# EAGLE design BMS12v3 (EAGLE 9.5.1)
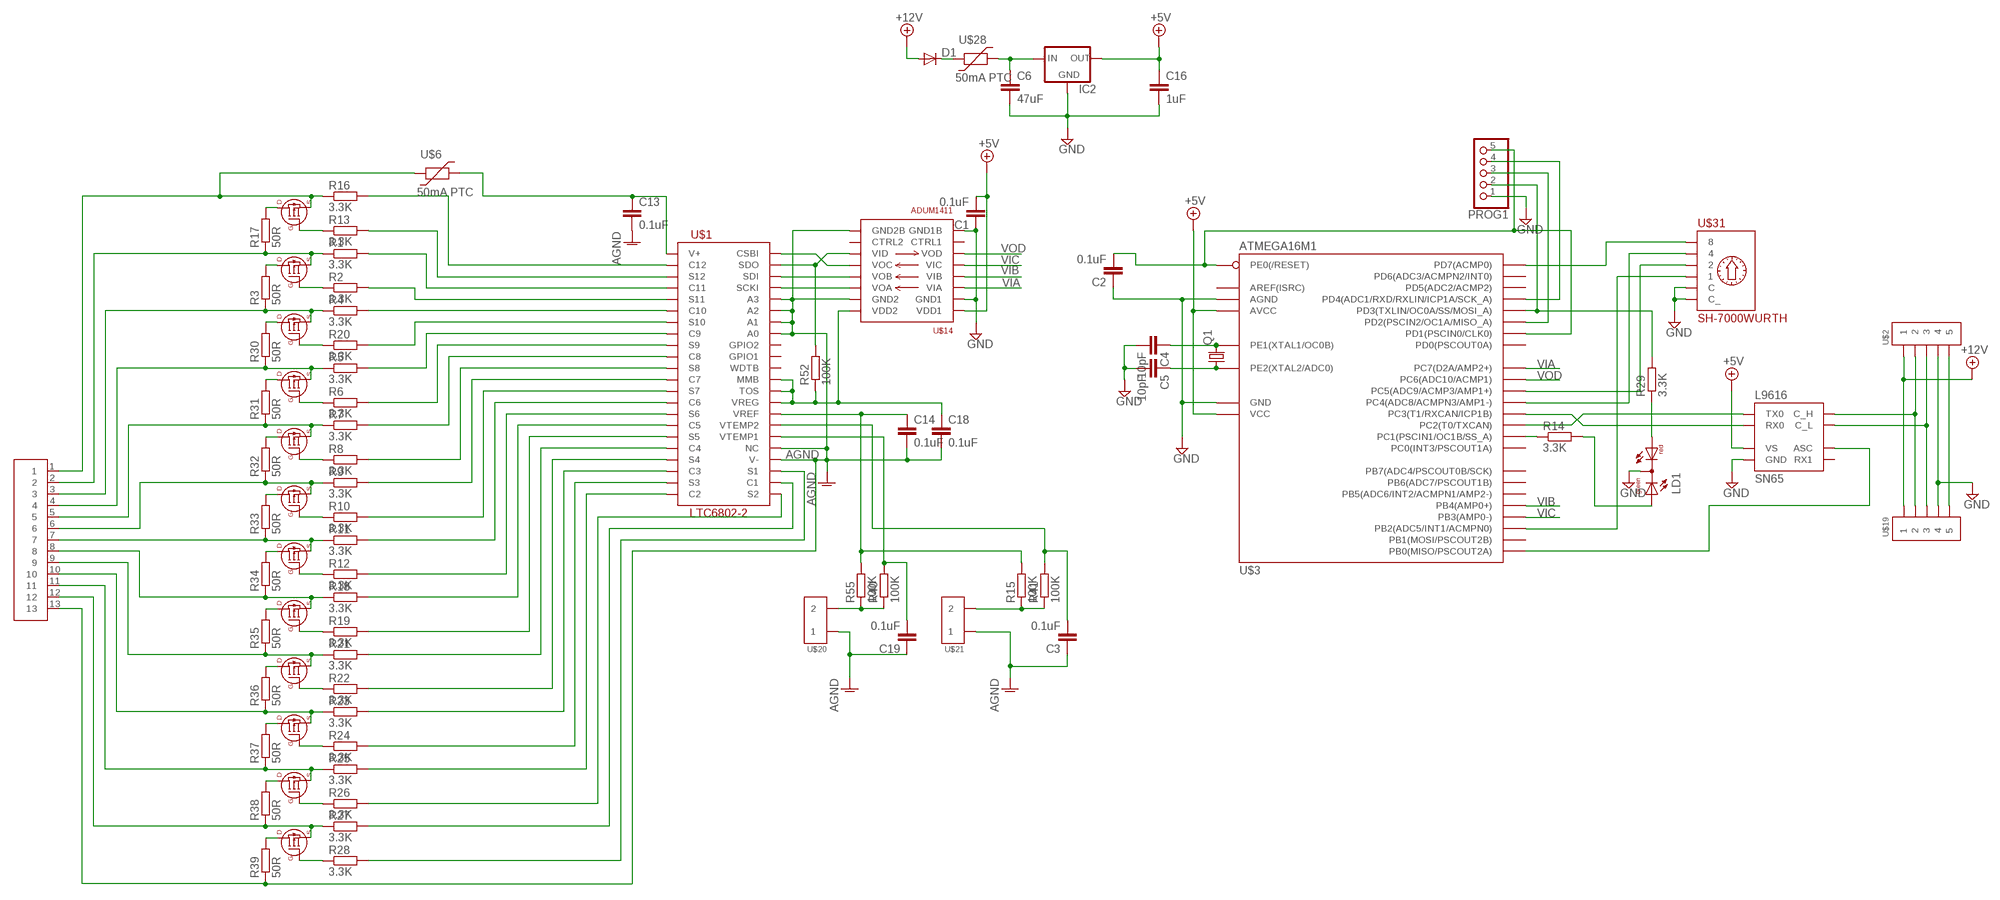
[diagram p0: schematic, sheet 1]

## Parts
C1  0.1uF  C-EUC0805  [C0805]
C2  0.1uF  C-EUC0805  [C0805]
C3  0.1uF  C-EUC0805  [C0805]
C4  10pF  C-EUC0805  [C0805]
C5  10pF  C-EUC0805  [C0805]
C6  47uF  C-EUC1206  [C1206]
C13  0.1uF  C-EUC0805  [C0805]
C14  0.1uF  C-EUC0805  [C0805]
C16  1uF  C-EUC0805  [C0805]
C18  0.1uF  C-EUC0805  [C0805]
C19  0.1uF  C-EUC0805  [C0805]
D1  DIODE-SOD123  [SOD123]
IC2  78LXXSOT89  [SOT89R]
LD1  DUOLED-RG-C  [DUOLED-C-5MM]
PROG1  PINHD-1X5  [1X05]
Q1  CRYSTALCTS406  [CTS406]
R1  3.3K  R-EU_R0805  [R0805]
R2  3.3K  R-EU_R0805  [R0805]
R3  50R  R-EU_R2512  [R2512]
R4  3.3K  R-EU_R0805  [R0805]
R5  3.3K  R-EU_R0805  [R0805]
R6  3.3K  R-EU_R0805  [R0805]
R7  3.3K  R-EU_R0805  [R0805]
R8  3.3K  R-EU_R0805  [R0805]
R9  3.3K  R-EU_R0805  [R0805]
R10  3.3K  R-EU_R0805  [R0805]
R11  3.3K  R-EU_R0805  [R0805]
R12  3.3K  R-EU_R0805  [R0805]
R13  3.3K  R-EU_R0805  [R0805]
R14  3.3K  R-EU_R0805  [R0805]
R15  100K  R-EU_R0805  [R0805]
R16  3.3K  R-EU_R0805  [R0805]
R17  50R  R-EU_R2512  [R2512]
R18  3.3K  R-EU_R0805  [R0805]
R19  3.3K  R-EU_R0805  [R0805]
R20  3.3K  R-EU_R0805  [R0805]
R21  3.3K  R-EU_R0805  [R0805]
R22  3.3K  R-EU_R0805  [R0805]
R23  3.3K  R-EU_R0805  [R0805]
R24  3.3K  R-EU_R0805  [R0805]
R25  3.3K  R-EU_R0805  [R0805]
R26  3.3K  R-EU_R0805  [R0805]
R27  3.3K  R-EU_R0805  [R0805]
R28  3.3K  R-EU_R0805  [R0805]
R29  3.3K  R-EU_R0805  [R0805]
R30  50R  R-EU_R2512  [R2512]
R31  50R  R-EU_R2512  [R2512]
R32  50R  R-EU_R2512  [R2512]
R33  50R  R-EU_R2512  [R2512]
R34  50R  R-EU_R2512  [R2512]
R35  50R  R-EU_R2512  [R2512]
R36  50R  R-EU_R2512  [R2512]
R37  50R  R-EU_R2512  [R2512]
R38  50R  R-EU_R2512  [R2512]
R39  50R  R-EU_R2512  [R2512]
R40  100K  R-EU_R0805  [R0805]
R41  100K  R-EU_R0805  [R0805]
R52  100K  R-EU_R0805  [R0805]
R55  100K  R-EU_R0805  [R0805]
SN65  L9616  [SOIC8]
U$1  LTC6802-2  [SSOP-44]
U$2  MOLEX-39502-1005  [MOLEX-39502-1005]
U$3  ATMEGA16M1  [TQFP32]
U$4  SI2351DS  [SOT23]
U$5  SI2351DS  [SOT23]
U$6  50mA PTC  1206_POLYSWITCH  [1206]
U$7  SI2351DS  [SOT23]
U$8  SI2351DS  [SOT23]
U$9  SI2351DS  [SOT23]
U$10  SI2351DS  [SOT23]
U$11  SI2351DS  [SOT23]
U$12  SI2351DS  [SOT23]
U$13  SI2351DS  [SOT23]
U$14  ADUM1411  [SOIC16W]
U$15  SI2351DS  [SOT23]
U$16  SI2351DS  [SOT23]
U$17  SI2351DS  [SOT23]
U$18  MOLEX_TERM_BLOCK_13  [MOLEX_TERM_BLOCK_13]
U$19  MOLEX-39502-1005  [MOLEX-39502-1005]
U$20  MOLEX-39502-1002  [MOLEX-39502-1002]
U$21  MOLEX-39502-1002  [MOLEX-39502-1002]
U$28  50mA PTC  1206_POLYSWITCH  [1206]
U$31  SH-7000WURTH  [WS-ROTV]

## Nets
+5V: C1.2 C16.1 IC2.2(OUT) SN65.P$3(VS) U$3.4(VCC) U$3.19(AVCC) U$14.1(VDD1)
+12V: D1.A U$2.1 U$19.1
AGND: C3.1 C13.2 C14.2 C18.2 C19.1 R39.1 U$1.26(V-) U$1.27(NC) U$1.37(A0) U$1.38(A1) U$1.39(A2) U$1.40(A3) U$14.9(GND2B) U$14.15(GND2) U$18.13 U$20.1 U$21.1
GND: C1.1 C2.1 C4.2 C5.2 C6.2 C16.2 IC2.4(GND) LD1.C PROG1.1 SN65.P$2(GND) U$2.4 U$3.5(GND) U$3.20(AGND) U$14.2(GND1) U$14.8(GND1B) U$19.4 U$31.C U$31.C2(C_)
N$1: D1.C U$28.P$1
N$2: R16.2 U$1.2(C12)
N$3: R13.2 U$1.3(S12)
N$4: R3.2 U$5.P$3(D)
N$5: R1.2 U$1.4(C11)
N$6: R1.1 R17.1 U$5.P$2(S) U$18.2
N$7: U$1.42(SDI) U$14.13(VOB)
N$8: R3.1 R4.1 U$7.P$2(S) U$18.3
N$9: R4.2 U$1.6(C10)
N$10: R26.2 U$1.23(S2)
N$11: U$1.41(SCKI) U$14.14(VOA)
N$12: R27.2 U$1.24(C1)
N$13: R28.2 U$1.25(S1)
N$14: R2.2 U$1.5(S11)
N$15: R52.2 U$1.43(SDO) U$14.11(VID)
N$16: U$1.44(CSBI) U$14.12(VOC)
N$17: R2.1 U$5.P$1(G)
N$18: R30.2 U$7.P$3(D)
N$19: C2.2 PROG1.5 U$3.31(PE0(/RESET)) U$3.32(PD1(PSCIN0/CLK0))
N$20: C6.1 IC2.1(IN) U$28.P$2
N$21: R5.2 U$1.8(C9)
N$22: R7.2 U$1.10(C8)
N$23: R9.2 U$1.12(C7)
N$24: R11.2 U$1.14(C6)
N$25: C18.1 R52.1 U$1.31(VREG) U$1.32(TOS) U$1.33(MMB) U$14.16(VDD2)
N$26: R18.2 U$1.16(C5)
N$27: R21.2 U$1.18(C4)
N$28: R23.2 U$1.20(C3)
N$29: R25.2 U$1.22(C2)
N$30: SN65.P$8(ASC) U$3.8(PB0(MISO/PSCOUT2A))
N$31: R5.1 R30.1 U$8.P$2(S) U$18.4
N$32: PROG1.2 R29.2 U$3.2(PD3(TXLIN/OC0A/SS/MOSI_A))
N$33: PROG1.3 U$3.1(PD2(PSCIN2/OC1A/MISO_A))
N$34: PROG1.4 U$3.12(PD4(ADC1/RXD/RXLIN/ICP1A/SCK_A))
N$36: SN65.P$4(RX0) U$3.7(PC3(T1/RXCAN/ICP1B))
N$37: SN65.P$1(TX0) U$3.6(PC2(T0/TXCAN))
N$38: SN65.P$7(C_H) U$2.2 U$19.2
N$39: SN65.P$6(C_L) U$2.3 U$19.3
N$40: LD1.AX(AG) R14.2
N$41: R14.1 U$3.3(PC1(PSCIN1/OC1B/SS_A))
N$42: U$3.15(PD7(ACMP0)) U$31.8
N$43: U$3.16(PB2(ADC5/INT1/ACMPN0)) U$31.1
N$44: U$3.17(PC4(ADC8/ACMPN3/AMP1-)) U$31.4
N$45: U$3.18(PC5(ADC9/ACMP3/AMP1+)) U$31.2
N$46: C3.2 R41.2 U$1.29(VTEMP2)
N$47: U$2.5 U$19.5
N$48: C4.1 Q1.3 U$3.10(PE1(XTAL1/OC0B))
N$49: C5.1 Q1.1 U$3.11(PE2(XTAL2/ADC0))
N$50: R17.2 U$4.P$3(D)
N$51: R16.1 U$4.P$2(S) U$6.P$1 U$18.1
N$52: R13.1 U$4.P$1(G)
N$53: R7.1 R31.1 U$9.P$2(S) U$18.5
N$54: R31.2 U$8.P$3(D)
N$55: R6.1 U$8.P$1(G)
N$56: R20.1 U$7.P$1(G)
N$57: R8.1 U$9.P$1(G)
N$58: R10.1 U$10.P$1(G)
N$59: R12.1 U$11.P$1(G)
N$60: R28.1 U$17.P$1(G)
N$61: R19.1 U$12.P$1(G)
N$62: R22.1 U$13.P$1(G)
N$63: R24.1 U$15.P$1(G)
N$64: R26.1 U$16.P$1(G)
N$65: R27.1 R38.1 U$17.P$2(S) U$18.12
N$66: C14.1 R15.2 R55.2 U$1.30(VREF)
N$67: C19.2 R40.2 U$1.28(VTEMP1)
N$68: LD1.AR R29.1
N$69: R25.1 R37.1 U$16.P$2(S) U$18.11
N$70: R23.1 R36.1 U$15.P$2(S) U$18.10
N$71: R38.2 U$16.P$3(D)
N$72: R39.2 U$17.P$3(D)
N$73: R37.2 U$15.P$3(D)
N$74: R21.1 R35.1 U$13.P$2(S) U$18.9
N$75: R36.2 U$13.P$3(D)
N$76: R18.1 R34.1 U$12.P$2(S) U$18.8
N$77: R35.2 U$12.P$3(D)
N$78: R11.1 R33.1 U$11.P$2(S) U$18.7
N$79: R9.1 R32.1 U$10.P$2(S) U$18.6
N$80: R33.2 U$10.P$3(D)
N$81: R34.2 U$11.P$3(D)
N$82: R32.2 U$9.P$3(D)
N$83: R24.2 U$1.21(S3)
N$84: R22.2 U$1.19(S4)
N$85: R40.1 R55.1 U$20.2
N$86: R15.1 R41.1 U$21.2
N$87: R20.2 U$1.7(S10)
N$88: R6.2 U$1.9(S9)
N$89: R8.2 U$1.11(S8)
N$90: R10.2 U$1.13(S7)
N$91: R12.2 U$1.15(S6)
N$93: R19.2 U$1.17(S5)
V+: C13.1 U$1.1(V+) U$6.P$2
VIA: U$3.25(PC7(D2A/AMP2+)) U$14.3(VIA)
VIB: U$3.24(PB4(AMP0+)) U$14.4(VIB)
VIC: U$3.23(PB3(AMP0-)) U$14.5(VIC)
VOD: U$3.22(PC6(ADC10/ACMP1)) U$14.6(VOD)
Unconnected: SN65.P$5(RX1) U$1.34(WDTB) U$1.35(GPIO1) U$1.36(GPIO2) U$3.9(PB1(MOSI/PSCOUT2B)) U$3.13(PD5(ADC2/ACMP2)) U$3.14(PD6(ADC3/ACMPN2/INT0)) U$3.21(AREF(ISRC)) U$3.26(PB5(ADC6/INT2/ACMPN1/AMP2-)) U$3.27(PB6(ADC7/PSCOUT1B)) U$3.28(PB7(ADC4/PSCOUT0B/SCK)) U$3.29(PD0(PSCOUT0A)) U$3.30(PC0(INT3/PSCOUT1A)) U$14.7(CTRL1) U$14.10(CTRL2)

## Library data of the parts
C1-C6 C13 C14 C16 C18 C19 = resistor:C-EU: CAPACITOR, European symbol
D1 = diode:DIODE-: DIODE
IC2 = v-reg:78LXX: VOLTAGE REGULATOR
LD1 = led:DUOLED-RG-C: DUO LED 2 colors (red/green), 5 mm, round, common Cathode www.ligitek.com or other producers.
PROG1 = pinhead:PINHD-1X5: PIN HEADER
Q1 = crystal:CRYSTAL: CRYSTAL
R1-R41 R52 R55 = resistor:R-EU_: RESISTOR, European symbol
SN65 = Ians parts:L9616
U$1 = Ians parts:LTC6802-2
U$2 U$19 = Ians parts:MOLEX-39502-1005
U$3 = Ians parts:ATMEGA16M1
U$4 U$5 U$7-U$13 U$15-U$17 = Ians parts:SI2351DS
U$6 U$28 = Ians parts:1206_POLYSWITCH
U$14 = Ians parts:ADUM1411
U$18 = Ians parts:MOLEX_TERM_BLOCK_13
U$20 U$21 = Ians parts:MOLEX-39502-1002
U$31 = Ians parts:SH-7000

## Board
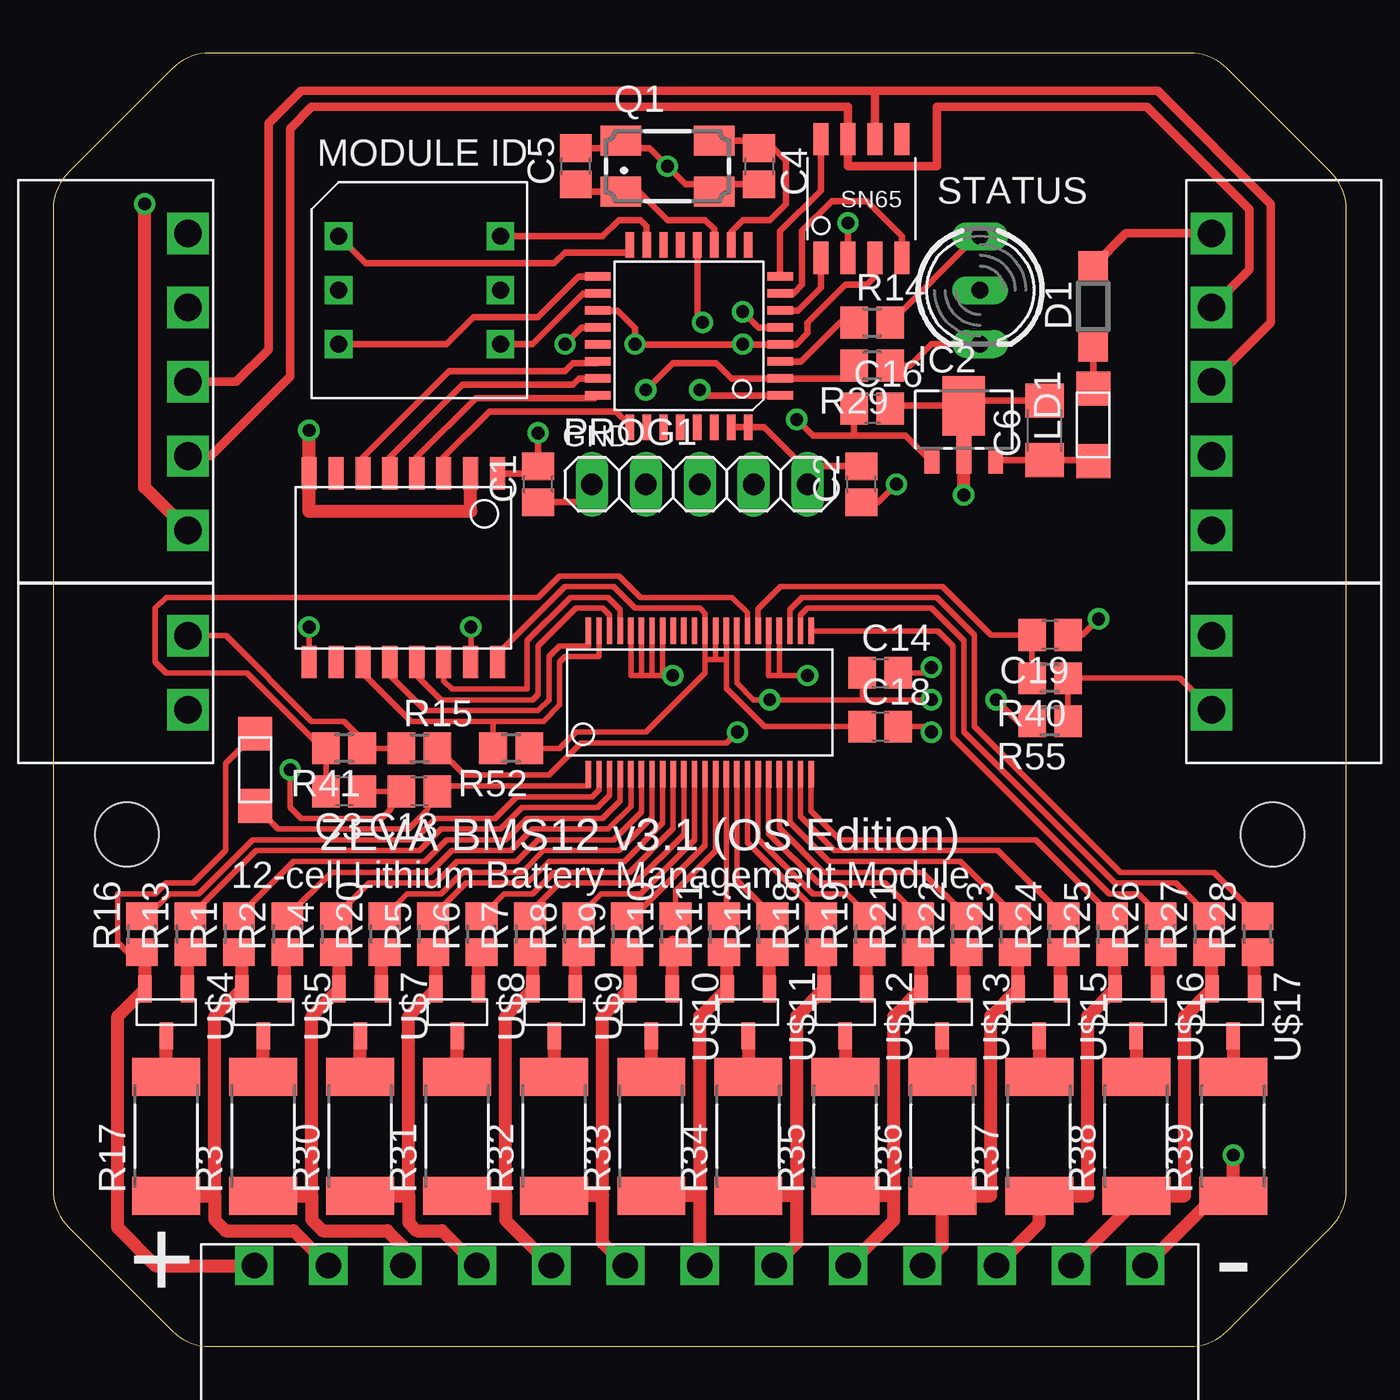
[diagram p1: board, top side]
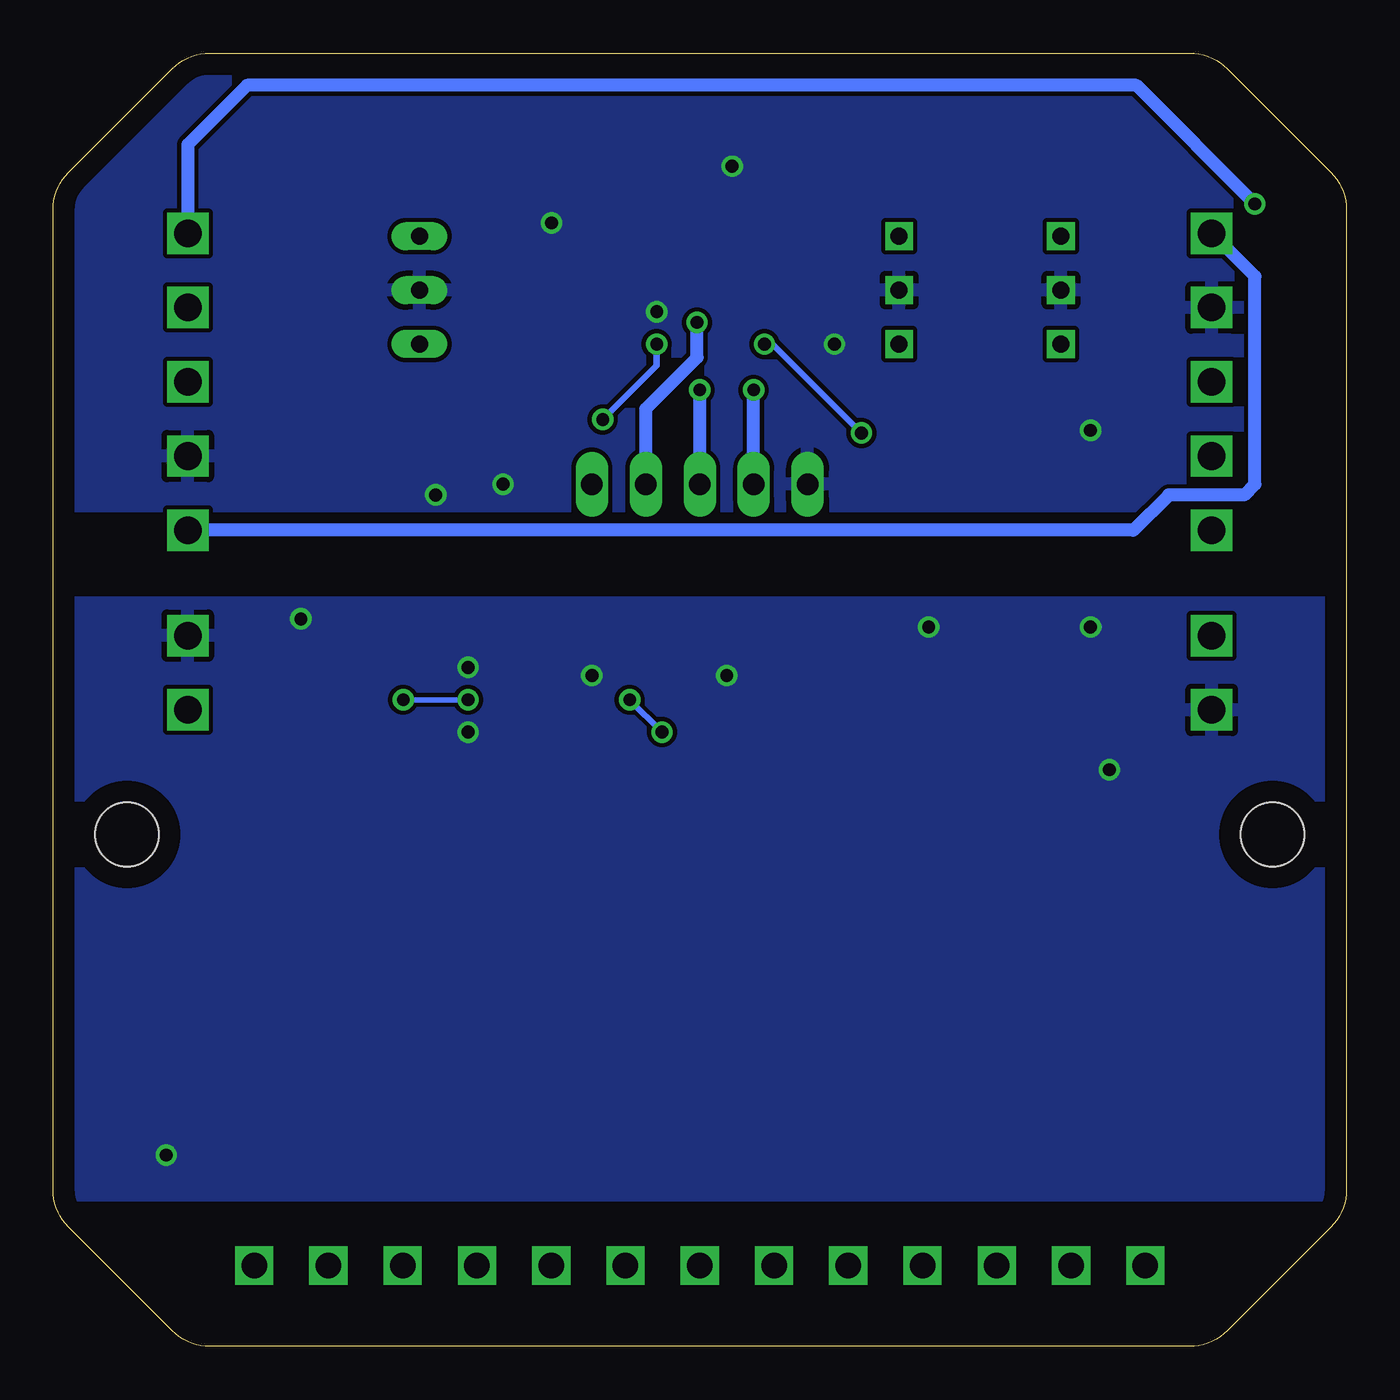
[diagram p2: board, bottom side, seen from below]

Size 60.96 x 60.96 mm. Coordinates in mm from the lower left corner, seen from the top.
Outline: 5.61,0.74 arc45 7.4,0 53.56,0 arc45 55.35,0.74 60.22,5.61 arc45 60.96,7.4 60.96,53.56 arc45 60.22,55.35 55.35,60.22 arc45 53.56,60.96 7.4,60.96 arc45 5.61,60.22 0.74,55.35 arc45 0,53.56 0,7.4 arc45 0.74,5.61 5.61,0.74
Copper layers (1*16): Top 0.035mm / dielectric 1.5mm / Bottom 0.035mm
Design rules "default *": minimum track width 10mil, minimum drill 10mil, track to track 8mil, track to pad 8mil, pad to pad 8mil, via to via 8mil, smd to smd 8mil, copper to edge 40mil, drill to drill 8mil, minimum pad ring 10mil, minimum via ring 8mil, stop-mask expansion 4mil, vias tented up to drill 0mil, thermal gap 10mil
Holes 3 mm at 3.48,24.13 57.48,24.13

### Footprints (pad centres in the part's own frame; a part is rotated, then mirrored left to right if it is on the bottom)
C0805 = smd 1.3 x 1.5: 1 -0.85,0; 2 0.85,0
C1206 = smd 1.6 x 1.8: 1 -1.4,0; 2 1.4,0
SOD123 = smd 1.4 x 1.4: A 1.9,0; C -1.9,0
SOT89R = smd 0.7 x 1.1: 1 1.5,-1.75; 2 -1.5,-1.75 | smd 0.7 x 1.8: 3 0,-1.4 | smd 2 x 2.8: 4 0,0.9
DUOLED-C-5MM = drill 0.813 long: AR 2.54,0; AX -2.54,0; C 0,0
1X05 = drill 1.016 long: 1 -5.08,0; 2 -2.54,0; 3 0,0; 4 2.54,0; 5 5.08,0
CTS406 = smd 1.9 x 1.4: 1 -2.2,-1.2; 2 2.2,-1.2; 3 2.2,1.2; 4 -2.2,1.2
R0805 = smd 1.3 x 1.5: 1 -0.85,0; 2 0.85,0
R2512 = smd 1.8 x 3.2: 1 -2.8,0; 2 2.8,0
SOIC8 = smd 1.524 x 0.711: P$1 -2.794,1.905; P$2 -2.794,0.635; P$3 -2.794,-0.635; P$4 -2.794,-1.905; P$5 2.794,-1.905; P$6 2.794,-0.635; P$7 2.794,0.635; P$8 2.794,1.905
SSOP-44 = smd 1.25 x 0.25: 1 -3.375,5.25; 2 -3.375,4.75; 3 -3.375,4.25; 4 -3.375,3.75; 5 -3.375,3.25; 6 -3.375,2.75; 7 -3.375,2.25; 8 -3.375,1.75; 9 -3.375,1.25; 10 -3.375,0.75; 11 -3.375,0.25; 12 -3.375,-0.25; 13 -3.375,-0.75; 14 -3.375,-1.25; 15 -3.375,-1.75; 16 -3.375,-2.25; 17 -3.375,-2.75; 18 -3.375,-3.25; 19 -3.375,-3.75; 20 -3.375,-4.25; 21 -3.375,-4.75; 22 -3.375,-5.25; 23 3.375,-5.25; 24 3.375,-4.75; 25 3.375,-4.25; 26 3.375,-3.75; 27 3.375,-3.25; 28 3.375,-2.75; 29 3.375,-2.25; 30 3.375,-1.75; 31 3.375,-1.25; 32 3.375,-0.75; 33 3.375,-0.25; 34 3.375,0.25; 35 3.375,0.75; 36 3.375,1.25; 37 3.375,1.75; 38 3.375,2.25; 39 3.375,2.75; 40 3.375,3.25; 41 3.375,3.75; 42 3.375,4.25; 43 3.375,4.75; 44 3.375,5.25
MOLEX-39502-1005 = drill 1.3 square: 1 -7,0; 2 -3.5,0; 3 0,0; 4 3.5,0; 5 7,0
TQFP32 = smd 1.2 x 0.4: 1 -4.3,2.8; 2 -4.3,2; 3 -4.3,1.2; 4 -4.3,0.4; 5 -4.3,-0.4; 6 -4.3,-1.2; 7 -4.3,-2; 8 -4.3,-2.8; 17 4.3,-2.8; 18 4.3,-2; 19 4.3,-1.2; 20 4.3,-0.4; 21 4.3,0.4; 22 4.3,1.2; 23 4.3,2; 24 4.3,2.8 | smd 0.4 x 1.2: 9 -2.8,-4.3; 10 -2,-4.3; 11 -1.2,-4.3; 12 -0.4,-4.3; 13 0.4,-4.3; 14 1.2,-4.3; 15 2,-4.3; 16 2.8,-4.3; 25 2.8,4.3; 26 2,4.3; 27 1.2,4.3; 28 0.4,4.3; 29 -0.4,4.3; 30 -1.2,4.3; 31 -2,4.3; 32 -2.8,4.3
SOT23 = smd 1.27 x 0.635: P$1 -1.1,1; P$2 -1.1,-1; P$3 1.1,0
1206 = smd 1.6 x 1.6: P$1 -1.7,0; P$2 1.7,0
SOIC16W = smd 1.524 x 0.711: 1 -4.445,4.445; 2 -4.445,3.175; 3 -4.445,1.905; 4 -4.445,0.635; 5 -4.445,-0.635; 6 -4.445,-1.905; 7 -4.445,-3.175; 8 -4.445,-4.445; 9 4.445,-4.445; 10 4.445,-3.175; 11 4.445,-1.905; 12 4.445,-0.635; 13 4.445,0.635; 14 4.445,1.905; 15 4.445,3.175; 16 4.445,4.445
MOLEX_TERM_BLOCK_13 = drill 1.2 square: 1 -21,0; 2 -17.5,0; 3 -14,0; 4 -10.5,0; 5 -7,0; 6 -3.5,0; 7 0,0; 8 3.5,0; 9 7,0; 10 10.5,0; 11 14,0; 12 17.5,0; 13 21,0
MOLEX-39502-1002 = drill 1.3 square: 1 -1.75,0; 2 1.75,0
WS-ROTV = drill 0.8 square: 1 -3.81,2.54; 2 3.81,-2.54; 4 -3.81,-2.54; 8 3.81,2.54; C -3.81,0; C2 3.81,0

### Placement (x,y rotation side)
C1  22.86,40.64 90 top
C2  38.1,40.64 90 top
C3  13.72,26.16 180 top
C4  33.27,55.63 270 top
C5  24.64,55.63 90 top
C6  46.74,43.18 90 top
C13  17.27,26.16 180 top
C14  38.99,31.75 0 top
C16  38.61,44.2 0 top
C18  38.99,29.21 0 top
C19  46.99,33.53 180 top
D1  49.02,49.02 90 top
IC2  42.93,43.43 0 top
LD1  43.69,49.78 270 top
PROG1  30.48,40.64 0 top
Q1  28.96,55.63 0 top
R1  8.76,19.43 90 top
R2  11.05,19.43 90 top
R3  9.91,9.91 90 top
R4  13.34,19.43 90 top
R5  17.91,19.43 90 top
R6  20.19,19.43 90 top
R7  22.48,19.43 90 top
R8  24.77,19.43 90 top
R9  27.05,19.43 90 top
R10  29.34,19.43 90 top
R11  31.62,19.43 90 top
R12  33.91,19.43 90 top
R13  6.48,19.43 90 top
R14  38.61,48.26 0 top
R15  17.27,28.19 0 top
R16  4.19,19.43 90 top
R17  5.33,9.91 90 top
R18  36.2,19.43 90 top
R19  38.48,19.43 90 top
R20  15.62,19.43 90 top
R21  40.77,19.43 90 top
R22  43.05,19.43 90 top
R23  45.34,19.43 90 top
R24  47.62,19.43 90 top
R25  49.91,19.43 90 top
R26  52.2,19.43 90 top
R27  54.48,19.43 90 top
R28  56.77,19.43 90 top
R29  38.61,46.23 180 top
R30  14.48,9.91 90 top
R31  19.05,9.91 90 top
R32  23.62,9.91 90 top
R33  28.19,9.91 90 top
R34  32.77,9.91 90 top
R35  37.34,9.91 90 top
R36  41.91,9.91 90 top
R37  46.48,9.91 90 top
R38  51.05,9.91 90 top
R39  55.63,9.91 90 top
R40  46.99,31.5 180 top
R41  13.72,28.19 180 top
R52  21.59,28.19 180 top
R55  46.99,29.46 180 top
SN65  38.1,54.1 90 top
U$1  30.48,30.35 90 top
U$2  6.35,45.47 90 top
U$3  29.97,47.62 180 top
U$4  5.33,15.75 270 top
U$5  9.91,15.75 270 top
U$6  9.53,27.18 270 top
U$7  14.48,15.75 270 top
U$8  19.05,15.75 270 top
U$9  23.62,15.75 270 top
U$10  28.19,15.75 270 top
U$11  32.77,15.75 270 top
U$12  37.34,15.75 270 top
U$13  41.91,15.75 270 top
U$14  16.51,36.7 270 top
U$15  46.48,15.75 270 top
U$16  51.05,15.75 270 top
U$17  55.63,15.75 270 top
U$18  30.48,3.81 0 top
U$19  54.61,45.47 270 top
U$20  54.61,31.75 270 top
U$21  6.35,31.75 90 top
U$28  49.02,43.43 270 top
U$31  17.27,49.78 0 top

### Tracks (layer width: path | path; a pad name or v marks a point on that pad's centre or on a via)
+5V  (via drill 0.6)
  Top 0.305: v22.86,43.05 C1.2 22.86,41.15 U$14.1 | SN65.P$3 38.73,50.42 38.35,50.04 37.34,50.04 35.56,48.26 35.56,47.75 35.03,47.23 U$3.4 32.51,47.23 | U$3.19 26.61,48.83 27.43,48.01 v27.43,47.24 27.45,47.23 32.51,47.23 | 32.51,47.23 v32.51,47.24 | v35.05,43.69 35.81,42.93 36.58,42.93 37.76,42.93 | 37.76,42.93 40.18,42.93 IC2.2 | 37.76,42.93 C16.1
  Bottom 0.305: v27.43,47.24 27.05,47.24 v22.86,43.05 | v32.51,47.24 32.51,46.23 v35.05,43.69
+12V  (via drill 0.6)
  Top 0.406: U$19.1 50.57,52.47 D1.A
  Top 0.61: U$2.1 4.32,40.5 v4.32,53.85
  Bottom 0.61: v4.32,53.85 9.91,59.44 51.82,59.44 54.61,56.64 U$19.1
AGND  (via drill 0.6)
  Top 0.254: 34.23,31.62 U$1.26 | 34.23,31.62 v35.56,31.62 | U$1.27 33.73,31.62 34.23,31.62 | U$1.37 28.73,31.62 v29.21,31.62 | U$1.38 28.23,31.62 v29.21,31.62 | U$1.39 27.73,31.62 v29.21,31.62 | U$1.40 27.23,31.62 v29.21,31.62 | U$14.15 v19.69,33.91 | U$14.9 v12.06,33.91 | C14.2 41.15,31.75 v41.4,32 | C18.2 41.15,29.21 v41.4,28.96 | C19.1 48.51,33.53 v49.28,34.29 | C3.1 C13.2 15.91,25.31 15.49,24.89 11.68,24.89 11.18,25.4 v11.18,27.18
  Top 0.61: U$18.13 54.78,7.11 R39.1 v55.63,9.02
  Bottom 0.61: v12.06,33.91 11.81,33.91
  pour Bottom: -1.52,7.11 61.98,7.11 62.23,35.05 -1.27,35.05
GND  (via drill 0.6)
  Top 0.305: U$3.5 33.26,48.02 v32.51,48.77 | SN65.P$2 v37.47,52.96 | v39.75,40.64 38.9,39.79 C2.1 | C1.1 25.4,39.79 PROG1.1 | C5.2 28.11,56.48 v28.96,55.63 29.81,54.78 C4.2 | C6.2 43.17,44.58 IC2.4 39.46,44.33 C16.2 | U$3.20 24.91,48.02 v24.13,47.24
  Top 0.61: U$14.2 19.68,39.37 12.06,39.37 U$14.8 v12.06,43.18 | v42.93,40.13 IC2.4
  pour Bottom: -1.27,39.62 -1.27,62.23 62.23,62.23 62.23,39.62
N$1
  Top 0.305: U$28.P$1 D1.C
N$2
  Top 0.254: U$1.2 25.73,26.24 25.4,25.91 21.84,25.91 20.83,24.89 18.03,24.89 17.02,23.88 9.4,23.88 6.86,21.34 5.5,21.34 4.45,20.28 R16.2
N$3
  Top 0.254: U$1.3 26.23,25.98 25.65,25.4 22.1,25.4 21.08,24.38 18.29,24.38 17.27,23.37 9.56,23.37 R13.2
N$4
  Top 0.61: R3.2 U$5.P$3
N$5
  Top 0.254: U$1.4 26.73,25.71 25.91,24.89 22.35,24.89 21.34,23.88 18.54,23.88 17.53,22.86 11.34,22.86 R1.2
N$6
  Top 0.61: U$18.2 11.33,5.46 8.13,5.46 7.62,5.97 7.62,7.11 | 7.62,7.11 7.62,15.56 U$5.P$2 8.91,18.44 R1.1 | R17.1 7.62,7.11
N$7
  Top 0.254: U$1.42 26.23,34.48 25.91,34.8 24.64,34.8 22.86,33.02 22.86,30.73 22.61,30.48 18.29,30.48 17.14,31.62 U$14.13
N$8
  Top 0.61: 12.19,7.11 12.19,15.56 U$7.P$2 13.48,18.44 R4.1 | U$18.3 16.48,4.73 15.75,5.46 12.7,5.46 12.19,5.97 12.19,7.11 | R3.1 12.19,7.11
N$9
  Top 0.254: U$1.6 27.73,25.19 26.42,23.88 22.86,23.88 21.84,22.86 19.05,22.86 18.03,21.84 14.9,21.84 R4.2
N$10
  Top 0.254: U$1.23 41.71,33.73 42.42,33.02 42.42,28.7 49.78,21.34 51.14,21.34 R26.2
N$11
  Top 0.254: U$1.41 26.73,34.74 26.16,35.31 24.38,35.31 22.35,33.27 22.35,30.99 18.8,30.99 18.41,31.37 U$14.14
N$12
  Top 0.254: U$1.24 35.23,34.47 35.56,34.8 41.4,34.8 42.93,33.27 42.93,28.96 50.04,21.84 52.92,21.84 R27.2
N$13
  Top 0.254: U$1.25 34.73,34.73 35.31,35.31 41.66,35.31 43.43,33.53 43.43,29.21 50.29,22.35 54.7,22.35 R28.2
N$14
  Top 0.254: U$1.5 27.23,25.45 26.16,24.38 22.61,24.38 21.59,23.37 18.8,23.37 17.78,22.35 13.12,22.35 R2.2
N$15
  Top 0.254: U$1.43 25.73,32.51 24.13,32.51 23.88,32.26 23.88,30.23 23.11,29.46 20.74,29.46 | U$14.11 14.61,31.73 16.87,29.46 20.74,29.46 | 20.74,29.46 R52.2
N$16
  Top 0.254: U$1.44 25.23,33.02 23.88,33.02 23.37,32.51 23.37,30.48 22.86,29.97 17.53,29.97 15.88,31.62 U$14.12
N$17
  Top 0.61: R2.1 10.91,18.44 U$5.P$1
N$18
  Top 0.61: R30.2 U$7.P$3
N$19
  Top 0.305: U$3.31 U$3.32 33.51,43.33 35.56,41.27 PROG1.5 35.56,41.49 C2.2
N$20
  Top 0.305: U$28.P$2 48.98,41.78 C6.1 44.52,41.78 IC2.1
N$21
  Top 0.254: U$1.8 28.73,24.67 26.92,22.86 23.37,22.86 22.35,21.84 19.47,21.84 R5.2
N$22
  Top 0.254: U$1.10 29.73,24.14 27.43,21.84 23.88,21.84 22.48,20.45 R7.2
N$23
  Top 0.254: U$1.12 30.73,23.62 27.69,20.57 27.34,20.57 R9.2
N$24
  Top 0.254: U$1.14 31.73,20.39 R11.2
N$25
  Top 0.254: 31.73,32.38 U$1.31 | 31.23,32.38 U$1.32 | 31.23,32.38 31.73,32.38 | 30.73,32.38 U$1.33 30.73,34.55 30.48,34.8 27.43,34.8 26.42,35.81 24.13,35.81 20.95,32.64 U$14.16 | 30.73,32.38 31.23,32.38 | 30.73,32.38 30.73,31.75 27.94,28.96 24.64,28.96 23.88,28.19 R52.1 | C18.1 33.53,29.21 31.73,31.01 31.73,32.38
N$26
  Top 0.254: U$1.16 32.73,23.75 R18.2
N$27
  Top 0.254: U$1.18 33.73,24.18 36.07,21.84 39.2,21.84 R21.2
N$28
  Top 0.254: U$1.20 34.73,24.71 36.58,22.86 42.76,22.86 R23.2
N$29
  Top 0.254: U$1.22 35.73,25.23 37.08,23.88 46.32,23.88 R25.2
N$30
  Top 0.305: SN65.P$8 36.2,54.48 34.27,52.56 U$3.8
N$31
  Top 0.61: 16.76,7.11 16.76,15.56 U$8.P$2 18.05,18.44 R5.1 | U$18.4 18.33,5.46 17.14,5.46 16.76,5.84 16.76,7.11 | R30.1 16.76,7.11
N$32  (via drill 0.6)
  Top 0.305: v27.94,45.09 29.21,46.35 31.24,46.35 31.97,45.62 U$3.2 37.16,45.62 R29.2
  Bottom 0.61: PROG1.2 v27.94,45.09
N$33  (via drill 0.6)
  Top 0.305: U$3.1 30.73,44.83 v30.48,45.09
  Bottom 0.61: PROG1.3 v30.48,45.09
N$34  (via drill 0.6)
  Top 0.305: U$3.12 30.37,48.49 v30.61,48.26
  Bottom 0.61: PROG1.4 33.02,44.2 30.61,46.61 v30.61,48.26
N$36
  Top 0.305: SN65.P$4 40.01,52.32 38.35,53.98 36.7,53.98 35.31,52.58 35.31,50.04 34.89,49.62 U$3.7
N$37
  Top 0.305: U$3.6 35.11,48.83 36.2,49.91 SN65.P$1
N$38
  Top 0.406: U$2.2 7.42,41.97 11.18,45.72 11.18,57.4 12.19,58.42 37.47,58.42 SN65.P$7 37.47,55.63 41.66,55.63 41.66,58.42 51.56,58.42 56.39,53.59 56.39,50.74 U$19.2
N$39
  Top 0.406: 38.73,59.18 SN65.P$6 | 38.73,59.18 52.07,59.18 57.4,53.85 57.4,48.26 U$19.3 | U$2.3 8.64,45.47 10.16,46.99 10.16,57.66 11.68,59.18 38.73,59.18
N$40
  Top 0.305: LD1.AX 43.52,52.32 R14.2
N$41
  Top 0.305: R14.1 37.08,48.26 35.25,46.42 U$3.3
N$42
  Top 0.305: U$3.15 27.97,52.8 27.69,53.09 26.67,53.09 25.91,52.32 U$31.8
N$43
  Top 0.305: U$31.1 14.73,51.05 23.62,51.05 24.13,51.56 27.17,51.56 U$3.16
N$44
  Top 0.305: U$3.17 24.77,50.42 22.86,48.51 19.81,48.51 18.54,47.24 U$31.4
N$45
  Top 0.305: U$3.18 24.99,49.62 22.61,47.24 U$31.2
N$46
  Top 0.254: U$1.29 32.73,34.58 32,35.31 27.69,35.31 26.67,36.32 23.88,36.32 22.86,35.31 5.33,35.31 4.83,34.8 4.83,32.26 5.33,31.75 9.14,31.75 12.7,28.19 R41.2 | R41.2 C3.2 | R41.2 12.7,27.69
N$47
  Bottom 0.61: U$19.5 10.05,38.47 8.38,40.13 4.83,40.13 4.32,40.64 4.32,50.43 U$2.5
N$48
  Top 0.305: Q1.3 33.05,56.83 C4.1 33.95,56.48 34.54,55.88 34.54,53.85 33.78,53.09 32.51,53.09 31.97,52.55 U$3.10
N$49
  Top 0.305: U$3.11 31.17,52.65 30.73,53.09 28.96,53.09 27.62,54.43 Q1.1 24.99,54.43 C5.1
N$50
  Top 0.61: R17.2 U$4.P$3
N$51
  Top 0.254: R16.1 3.52,18.58 3.05,19.05 3.05,21.34 4.83,21.34 5.33,21.84 6.6,21.84 8.13,23.37 8.13,27.48 U$6.P$1
  Top 0.61: U$18.1 4.83,3.81 3.05,5.59 3.05,15.56 U$4.P$2 4.33,18.44 R16.1
N$52
  Top 0.61: R13.1 6.33,18.44 U$4.P$1
N$53
  Top 0.61: 21.34,7.11 21.34,15.56 U$9.P$2 22.62,18.44 R7.1 | U$18.5 21.34,5.95 21.34,7.11 | R31.1 21.34,7.11
N$54
  Top 0.61: R31.2 U$8.P$3
N$55
  Top 0.61: R6.1 20.05,18.44 U$8.P$1
N$56
  Top 0.61: R20.1 15.48,18.44 U$7.P$1
N$57
  Top 0.61: R8.1 24.62,18.44 U$9.P$1
N$58
  Top 0.61: R10.1 29.21,18.71 29.21,19.05 29.19,19.03 U$10.P$1
N$59
  Top 0.61: R12.1 33.77,18.44 U$11.P$1
N$60
  Top 0.61: R28.1 56.63,18.44 U$17.P$1
N$61
  Top 0.61: R19.1 38.34,18.44 U$12.P$1
N$62
  Top 0.61: R22.1 42.91,18.44 U$13.P$1
N$63
  Top 0.61: R24.1 47.48,18.44 U$15.P$1
N$64
  Top 0.61: R26.1 52.05,18.44 U$16.P$1
N$65
  Top 0.61: U$18.12 51.05,6.88 R38.1 53.34,7.11 53.34,15.56 U$17.P$2 54.63,18.44 R27.1
N$66  (via drill 0.6)
  Top 0.254: U$1.30 32.23,31.27 33.02,30.48 v33.78,30.48 38.14,30.48 | 38.14,30.48 v41.4,30.48 | 38.14,30.48 C14.1 | R55.2 45.47,29.46 v44.45,30.48 | v32.26,28.96 31.75,28.45 24.89,28.45 23.37,26.92 19.39,26.92 R15.2
  Bottom 0.254: v41.4,30.48 v44.45,30.48 | v32.26,28.96 v33.78,30.48
N$67
  Top 0.254: U$1.28 33.23,34.75 34.29,35.81 41.91,35.81 44.2,33.53 C19.2 R40.2
N$68
  Top 0.305: LD1.AR 41.4,47.24 40.39,46.23 R29.1
N$69
  Top 0.61: U$18.11 46.48,5.81 R37.1 48.77,7.11 48.77,15.56 U$16.P$2 50.05,18.44 R25.1
N$70
  Top 0.61: U$18.10 41.91,4.74 R36.1 44.2,7.11 44.2,15.56 U$15.P$2 45.48,18.44 R23.1
N$71
  Top 0.61: U$16.P$3 R38.2
N$72
  Top 0.61: U$17.P$3 R39.2
N$73
  Top 0.61: U$15.P$3 R37.2
N$74
  Top 0.61: 39.62,7.11 39.62,5.95 U$18.9 | 39.62,7.11 R35.1 | 39.62,7.11 39.62,15.56 U$13.P$2 40.91,18.44 R21.1
N$75
  Top 0.61: U$13.P$3 R36.2
N$76
  Top 0.61: 35.05,7.11 35.05,15.56 U$12.P$2 36.34,18.44 R18.1 | U$18.8 35.05,4.88 35.05,7.11 | 35.05,7.11 R34.1
N$77
  Top 0.61: U$12.P$3 R35.2
N$78
  Top 0.61: 30.48,7.11 30.48,15.56 U$11.P$2 31.77,18.44 R11.1 | 30.48,7.11 R33.1 | U$18.7 30.48,7.11
N$79
  Top 0.61: U$18.6 25.91,4.88 25.91,7.11 | 25.91,7.11 25.91,15.56 U$10.P$2 27.19,18.44 R9.1 | 25.91,7.11 R32.1
N$80
  Top 0.61: U$10.P$3 R33.2
N$81
  Top 0.61: U$11.P$3 R34.2
N$82
  Top 0.61: U$9.P$3 R32.2
N$83
  Top 0.254: U$1.21 35.23,24.97 36.83,23.37 44.54,23.37 R24.2
N$84
  Top 0.254: U$1.19 34.23,24.44 36.32,22.35 40.98,22.35 R22.2
N$85
  Top 0.254: R55.1 R40.1 53.11,31.5 U$20.2
N$86
  Top 0.254: R15.1 R41.1 14.48,28.28 14.48,28.7 13.72,29.46 12.19,29.46 8.16,33.5 U$21.2
N$87
  Top 0.254: U$1.7 28.23,24.93 26.67,23.37 23.11,23.37 22.1,22.35 19.3,22.35 18.29,21.34 16.68,21.34 R20.2
N$88
  Top 0.254: U$1.9 29.23,24.4 27.18,22.35 23.62,22.35 22.61,21.34 21.25,21.34 R6.2
N$89
  Top 0.254: R8.2 25.82,21.34 27.69,21.34 30.23,23.88 U$1.11
N$90
  Top 0.254: U$1.13 31.23,23.36 29.34,21.46 R10.2
N$91
  Top 0.254: U$1.15 32.23,21.96 R12.2
N$93
  Top 0.254: U$1.17 33.23,23.92 35.81,21.34 37.43,21.34 R19.2
V+
  Top 0.254: U$1.1 25.23,26.42 17.87,26.42 C13.1 17.61,25.23 16.76,24.38 10.62,24.38 U$6.P$2
VIA
  Top 0.305: U$14.3 18.41,41.91 20.57,44.07 26.54,44.07 27.17,43.44 U$3.25
VIB
  Top 0.305: U$14.4 17.14,41.91 19.94,44.7 25.55,44.7 U$3.24
VIC
  Top 0.305: U$14.5 15.88,41.91 19.3,45.34 24.51,45.34 24.8,45.62 U$3.23
VOD
  Top 0.305: U$3.22 25.67,46.35 24.51,46.35 24.13,45.97 18.67,45.97 14.61,41.91 U$14.6
  Top 0.406: U$14.6 14.73,41.27

### Text on the board
tPlace: MODULE ID | STATUS | GND | ZEVA BMS12 v3.1 (OS Edition) | 12-cell Lithium Battery Management Module | + | -